# EAGLE design motoko_ice_dragon_x_dc (EAGLE 9.6.0)
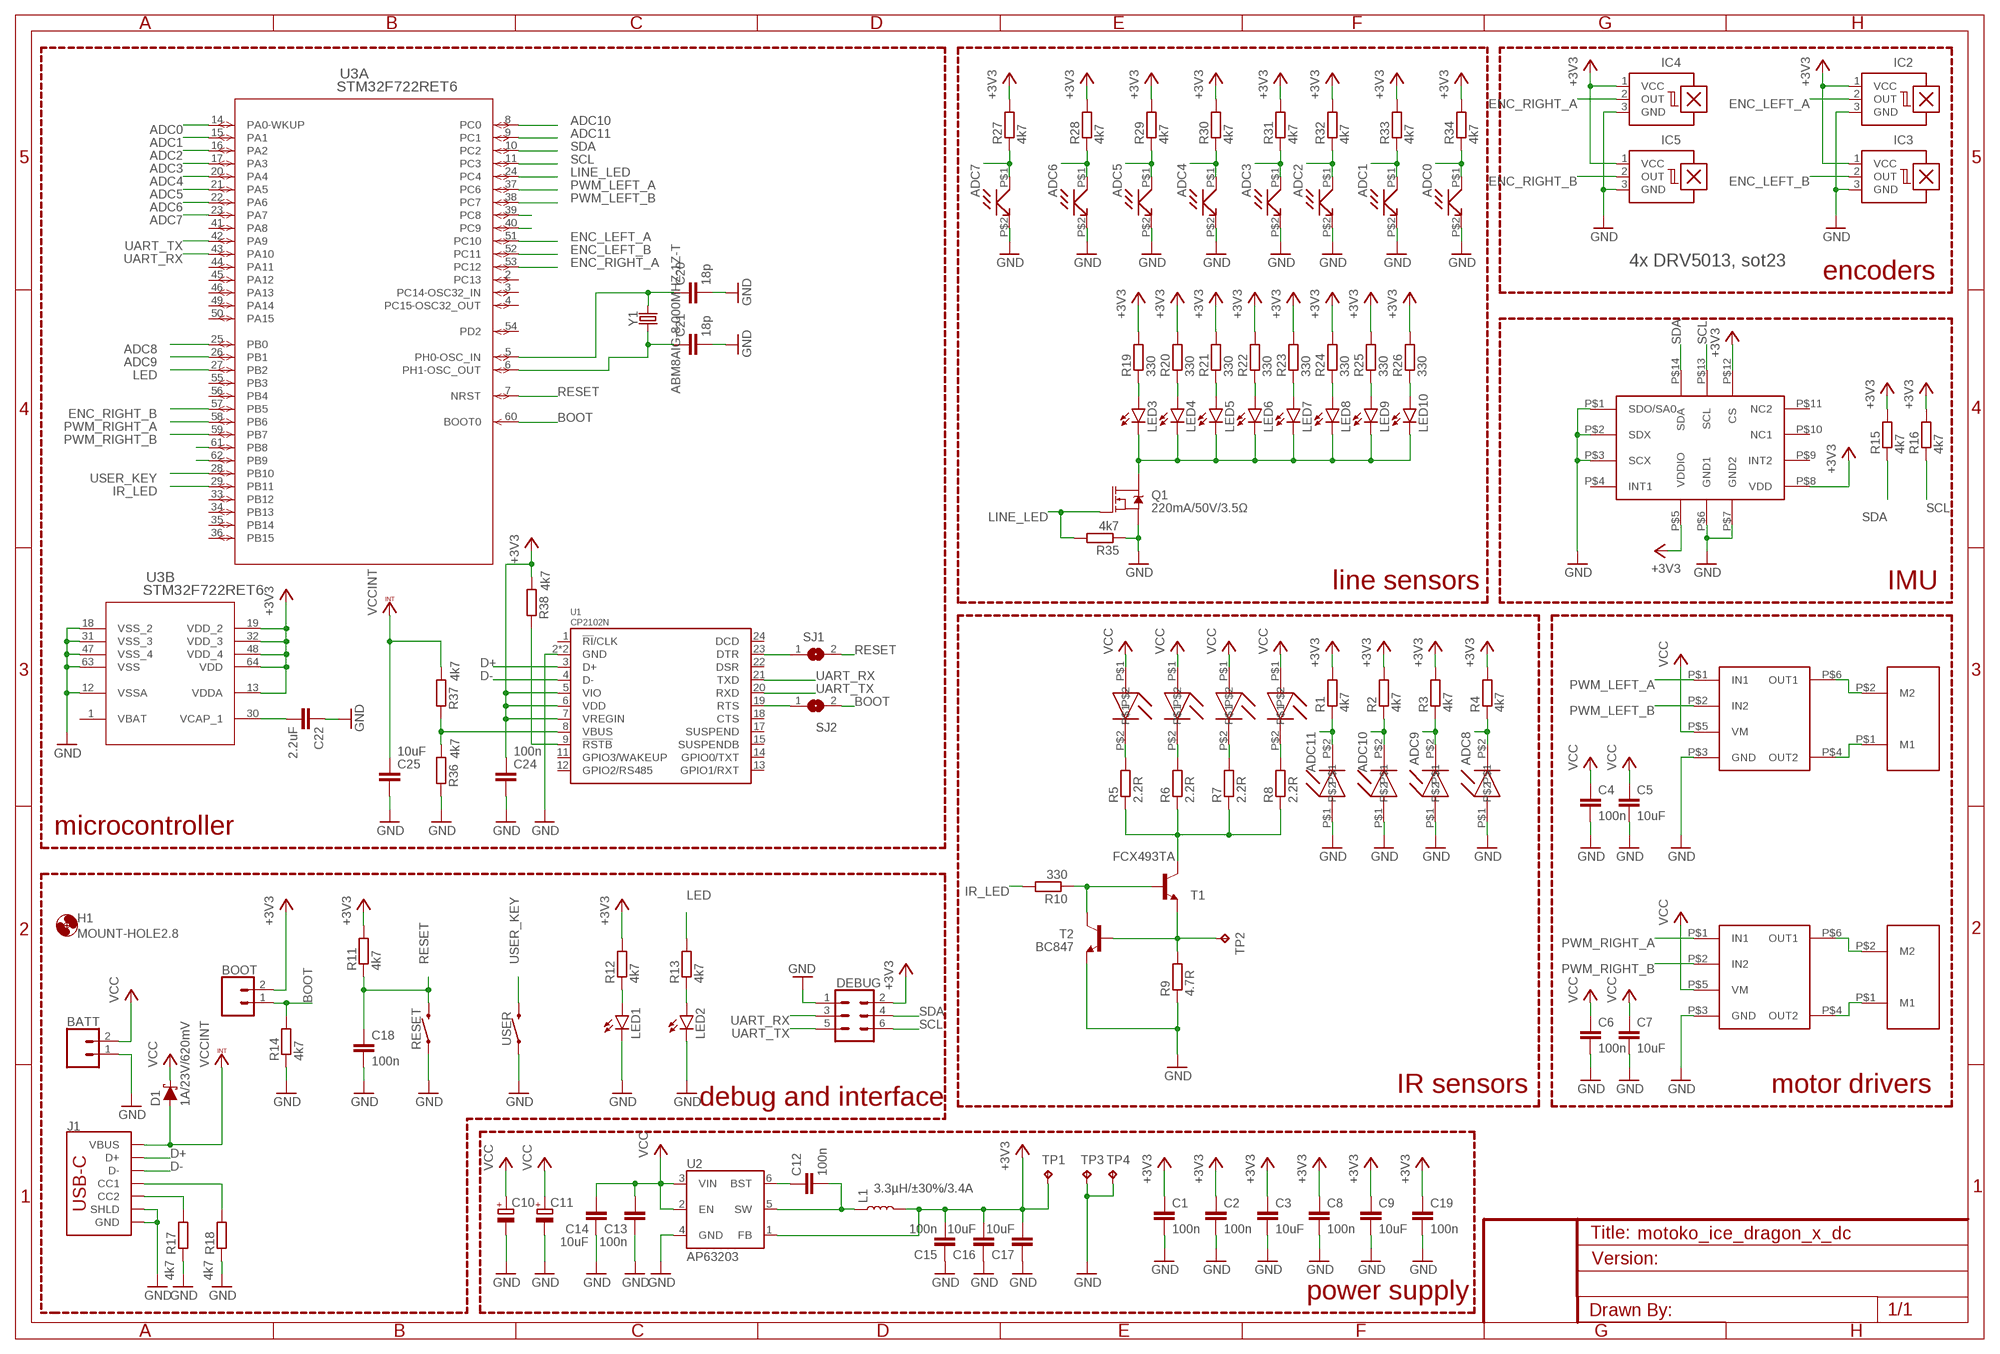
[diagram p0: schematic, sheet 1]

## Parts
BATT  CONN_02LOCK_LONGPADS  [1X02_LOCK_LONGPADS]
BOOT  CONN_02LOCK_LONGPADS  [1X02_LOCK_LONGPADS]
C1  100n  C-EUC0805  [C0805]
C2  100n  C-EUC0805  [C0805]
C3  10uF  C-EUC0805  [C0805]
C4  100n  C-EUC0805  [C0805]
C5  10uF  C-EUC0805  [C0805]
C6  100n  C-EUC0805  [C0805]
C7  10uF  C-EUC0805  [C0805]
C8  100n  C-EUC0805  [C0805]
C9  10uF  C-EUC0805  [C0805]
C10  CPOL-EU140CLH-0810  [140CLH-0810]
C11  CPOL-EU140CLH-0810  [140CLH-0810]
C12  100n  C-EUC0805  [C0805]
C13  100n  C-EUC0805  [C0805]
C14  10uF  C-EUC0805  [C0805]
C15  100n  C-EUC0805  [C0805]
C16  10uF  C-EUC0805  [C0805]
C17  10uF  C-EUC0805  [C0805]
C18  100n  C-EUC0805  [C0805]
C19  100n  C-EUC0805  [C0805]
C20  18p  C-EUC0805  [C0805]
C21  18p  C-EUC0805  [C0805]
C22  2.2uF  C-EUC0805  [C0805]
C24  100n  C-EUC0805  [C0805]
C25  10uF  C-EUC0805  [C0805]
D1  1A/23V/620mV  DIODE-SCHOTTKY-BAT20J  [SOD-323]
DEBUG  FEMALE 2x3  CONN_03X2FEMALE  [2X3]
H1  MOUNT-HOLE2.8  [2,8]
IC2  A1202LH  [SOT23-W]
IC3  A1202LH  [SOT23-W]
IC4  A1202LH  [SOT23-W]
IC5  A1202LH  [SOT23-W]
J1  640-USB4105-GF-A-120, man. GCT  USB_C_2-LAYER_PADS  [USB-C-16P-2LAYER-PADS]
L1  3.3µH/±30%/3.4A  INDUCTOR-CR54-3.3UH  [CR54]
LED1  LEDCHIPLED_1206  [CHIPLED_1206]
LED2  LEDCHIPLED_1206  [CHIPLED_1206]
LED3  LEDCHIPLED_1206  [CHIPLED_1206]
LED4  LEDCHIPLED_1206  [CHIPLED_1206]
LED5  LEDCHIPLED_1206  [CHIPLED_1206]
LED6  LEDCHIPLED_1206  [CHIPLED_1206]
LED7  LEDCHIPLED_1206  [CHIPLED_1206]
LED8  LEDCHIPLED_1206  [CHIPLED_1206]
LED9  LEDCHIPLED_1206  [CHIPLED_1206]
LED10  LEDCHIPLED_1206  [CHIPLED_1206]
Q1  220mA/50V/3.5Ω  MOSFET-NCH-BSS138  [SOT23-3]
R1  4k7  R-EU_M0805  [M0805]
R2  4k7  R-EU_M0805  [M0805]
R3  4k7  R-EU_M0805  [M0805]
R4  4k7  R-EU_M0805  [M0805]
R5  2.2R  R-EU_M0805  [M0805]
R6  2.2R  R-EU_M0805  [M0805]
R7  2.2R  R-EU_M0805  [M0805]
R8  2.2R  R-EU_M0805  [M0805]
R9  4.7R  R-EU_M0805  [M0805]
R10  330  R-EU_M0805  [M0805]
R11  4k7  R-EU_M0805  [M0805]
R12  4k7  R-EU_M0805  [M0805]
R13  4k7  R-EU_M0805  [M0805]
R14  4k7  R-EU_M0805  [M0805]
R15  4k7  R-EU_M0805  [M0805]
R16  4k7  R-EU_M0805  [M0805]
R17  4k7  R-EU_M0805  [M0805]
R18  4k7  R-EU_M0805  [M0805]
R19  330  R-EU_M0805  [M0805]
R20  330  R-EU_M0805  [M0805]
R21  330  R-EU_M0805  [M0805]
R22  330  R-EU_M0805  [M0805]
R23  330  R-EU_M0805  [M0805]
R24  330  R-EU_M0805  [M0805]
R25  330  R-EU_M0805  [M0805]
R26  330  R-EU_M0805  [M0805]
R27  4k7  R-EU_M0805  [M0805]
R28  4k7  R-EU_M0805  [M0805]
R29  4k7  R-EU_M0805  [M0805]
R30  4k7  R-EU_M0805  [M0805]
R31  4k7  R-EU_M0805  [M0805]
R32  4k7  R-EU_M0805  [M0805]
R33  4k7  R-EU_M0805  [M0805]
R34  4k7  R-EU_M0805  [M0805]
R35  4k7  R-EU_M0805  [M0805]
R36  4k7  R-EU_M0805  [M0805]
R37  4k7  R-EU_M0805  [M0805]
R38  4k7  R-EU_M0805  [M0805]
RESET  MOMENTARY-SWITCH-SPST-SMD-6.2MM-TALL  [TACTILE_SWITCH_SMD_6.2MM_TALL]
SJ1  SJ  [SJ]
SJ2  SJ  [SJ]
T1  FCX493TA  -NPN-SOT89-BCE  [SOT89-BCE]
T2  BC847  [SOT23]
TP1  TPB1,27  [B1,27]
TP2  TPB1,27  [B1,27]
TP3  TPB1,27  [B1,27]
TP4  TPB1,27  [B1,27]
U1  CP2102N  [QFN24]
U2  AP63203  [SOT23-6]
U3  STM32F722RET6  [LQFP64-10X10MM]
U$1  DRV8212  [SOT_0.6MM]
U$2  SFH3710  [SFH710]
U$3  DRV8212  [SOT_0.6MM]
U$4  POLOLU_MICRO_METAL_GEAR_MOTOR  [POLOLU_MICRO_METAL_GEAR_MOTOR]
U$5  POLOLU_MICRO_METAL_GEAR_MOTOR  [POLOLU_MICRO_METAL_GEAR_MOTOR]
U$6  LSM6DSM  [LGA14L]
U$7  LED_5MM_AXIAL  [LED_5MM_AXIAL]
U$8  LED_5MM_AXIAL  [LED_5MM_AXIAL]
U$9  LED_5MM_AXIAL  [LED_5MM_AXIAL]
U$10  LED_5MM_AXIAL  [LED_5MM_AXIAL]
U$11  LED_5MM_AXIAL  [LED_5MM_AXIAL]
U$12  LED_5MM_AXIAL  [LED_5MM_AXIAL]
U$13  LED_5MM_AXIAL  [LED_5MM_AXIAL]
U$14  LED_5MM_AXIAL  [LED_5MM_AXIAL]
U$15  SFH3710  [SFH710]
U$16  SFH3710  [SFH710]
U$17  SFH3710  [SFH710]
U$18  SFH3710  [SFH710]
U$19  SFH3710  [SFH710]
U$20  SFH3710  [SFH710]
U$21  SFH3710  [SFH710]
USER  MOMENTARY-SWITCH-SPST-SMD-6.2MM-TALL  [TACTILE_SWITCH_SMD_6.2MM_TALL]
Y1  ABM8AIG-8.000MHZ-1Z-T  CRYSTALSMD-3.2X2.5  [CRYSTAL-SMD-3.2X2.5MM]

## Nets
+3V3: BOOT.2 C1.1 C2.1 C3.1 C8.1 C9.1 C15.2 C16.2 C17.2 C19.1 C24.1 DEBUG.2 IC2.1(VCC) IC3.1(VCC) IC4.1(VCC) IC5.1(VCC) L1.P$2 R1.2 R2.2 R3.2 R4.2 R11.2 R12.2 R15.2 R16.2 R19.2 R20.2 R21.2 R22.2 R23.2 R24.2 R25.2 R26.2 R27.2 R28.2 R29.2 R30.2 R31.2 R32.2 R33.2 R34.2 R38.1 TP1.TP U1.5(VIO) U1.6(VDD) U1.7(VREGIN) U2.1(FB) U3.13(B:VDDA) U3.19(B:VDD_2) U3.32(B:VDD_3) U3.48(B:VDD_4) U3.64(B:VDD) U$6.P$5(VDDIO) U$6.P$8(VDD) U$6.P$12(CS)
ADC0: R34.1 U3.14(A:PA0-WKUP) U$21.P$1(C)
ADC1: R33.1 U3.15(A:PA1) U$20.P$1(C)
ADC2: R32.1 U3.16(A:PA2) U$19.P$1(C)
ADC3: R31.1 U3.17(A:PA3) U$18.P$1(C)
ADC4: R30.1 U3.20(A:PA4) U$17.P$1(C)
ADC5: R29.1 U3.21(A:PA5) U$16.P$1(C)
ADC6: R28.1 U3.22(A:PA6) U$15.P$1(C)
ADC7: R27.1 U3.23(A:PA7) U$2.P$1(C)
ADC8: R4.1 U3.25(A:PB0) U$7.P$2
ADC9: R3.1 U3.26(A:PB1) U$11.P$2
ADC10: R2.1 U3.8(A:PC0) U$14.P$2
ADC11: R1.1 U3.9(A:PC1) U$9.P$2
BOOT: BOOT.1 R14.2 SJ2.2 U3.60(A:BOOT0)
D+: J1.A6(D+) J1.B6(D+) U1.3(D+)
D-: J1.A7(D-) J1.B7(D-) U1.4(D-)
ENC_LEFT_A: IC2.2(OUT) U3.51(A:PC10)
ENC_LEFT_B: IC3.2(OUT) U3.52(A:PC11)
ENC_RIGHT_A: IC4.2(OUT) U3.53(A:PC12)
ENC_RIGHT_B: IC5.2(OUT) U3.57(A:PB5)
GND: BATT.1 C1.2 C2.2 C3.2 C4.2 C5.2 C6.2 C7.2 C8.2 C9.2 C10.- C11.- C13.1 C14.1 C15.1 C16.1 C17.1 C18.2 C19.2 C20.2 C21.2 C22.1 C24.2 C25.2 DEBUG.1 IC2.3(GND) IC3.3(GND) IC4.3(GND) IC5.3(GND) J1.GND J1.GND2(GND) J1.SHLD1(SHLD) J1.SHLD2(SHLD) J1.SHLD3(SHLD) J1.SHLD4(SHLD) LED1.C LED2.C Q1.2(S) R9.1 R14.1 R17.1 R18.1 R35.1 R36.2 RESET.A2 T2.2(E) TP3.TP TP4.TP U1.2(GND) U1.PAD(GND) U2.4(GND) U3.12(B:VSSA) U3.18(B:VSS_2) U3.31(B:VSS_3) U3.47(B:VSS_4) U3.63(B:VSS) U$1.P$3(GND) U$2.P$2(E) U$3.P$3(GND) U$6.P$1(SDO/SA0) U$6.P$2(SDX) U$6.P$3(SCX) U$6.P$6(GND1) U$6.P$7(GND2) U$7.P$1 U$9.P$1 U$11.P$1 U$14.P$1 U$15.P$2(E) U$16.P$2(E) U$17.P$2(E) U$18.P$2(E) U$19.P$2(E) U$20.P$2(E) U$21.P$2(E) USER.A2
IR_LED: R10.2 U3.29(A:PB11)
LED: R13.2 U3.27(A:PB2)
LINE_LED: Q1.1(G) R35.2 U3.24(A:PC4)
N$1: U$1.P$6(OUT1) U$4.P$2(M2)
N$2: U$1.P$4(OUT2) U$4.P$1(M1)
N$3: U$3.P$6(OUT1) U$5.P$2(M2)
N$4: U$3.P$4(OUT2) U$5.P$1(M1)
N$5: R5.2 U$10.P$2
N$6: R6.2 U$13.P$2
N$7: R7.2 U$12.P$2
N$8: R8.2 U$8.P$2
N$9: SJ2.1 U1.19(RTS)
N$10: R9.2 T1.E T2.1(B) TP2.TP
N$11: J1.B5(CC2) R17.2
N$12: C12.1 U2.6(BST)
N$13: C12.2 L1.P$1 U2.5(SW)
N$14: R10.1 T1.B T2.3(C)
N$15: R5.1 R6.1 R7.1 R8.1 T1.C
N$16: LED1.A R12.1
N$17: LED2.A R13.1
N$18: J1.A5(CC1) R18.2
N$19: C20.1 U3.5(A:PH0-OSC_IN) Y1.3
N$20: C21.1 U3.6(A:PH1-OSC_OUT) Y1.1
N$21: LED3.A R19.1
N$22: LED4.A R20.1
N$23: C22.2 U3.30(B:VCAP_1)
N$24: LED5.A R21.1
N$25: LED6.A R22.1
N$26: LED7.A R23.1
N$27: LED8.A R24.1
N$28: LED9.A R25.1
N$29: LED10.A R26.1
N$30: LED3.C LED4.C LED5.C LED6.C LED7.C LED8.C LED9.C LED10.C Q1.3(D)
N$31: SJ1.1 U1.23(DTR)
N$32: R38.2 U1.9(!RSTB)
N$33: U3.61(A:PB8)
N$34: U3.62(A:PB9)
N$35: U3.39(A:PC8)
N$36: U3.40(A:PC9)
N$38: R36.1 R37.2 U1.8(VBUS)
PWM_LEFT_A: U3.37(A:PC6) U$1.P$1(IN1)
PWM_LEFT_B: U3.38(A:PC7) U$1.P$2(IN2)
PWM_RIGHT_A: U3.58(A:PB6) U$3.P$1(IN1)
PWM_RIGHT_B: U3.59(A:PB7) U$3.P$2(IN2)
RESET: C18.1 R11.1 RESET.B2 SJ1.2 U3.7(A:NRST)
SCL: DEBUG.6 R16.1 U3.11(A:PC3) U$6.P$13(SCL)
SDA: DEBUG.4 R15.1 U3.10(A:PC2) U$6.P$14(SDA)
UART_RX: DEBUG.3 U1.21(TXD) U3.43(A:PA10)
UART_TX: DEBUG.5 U1.20(RXD) U3.42(A:PA9)
USER_KEY: U3.28(A:PB10) USER.B2
VCC: BATT.2 C4.1 C5.1 C6.1 C7.1 C10.+ C11.+ C13.2 C14.2 D1.C U2.2(EN) U2.3(VIN) U$1.P$5(VM) U$3.P$5(VM) U$8.P$1 U$10.P$1 U$12.P$1 U$13.P$1
VCCINT: C25.1 D1.A J1.VBUS1(VBUS) J1.VBUS2(VBUS) R37.1
Unconnected: U1.1(!RI!/CLK) U1.11(GPIO3/WAKEUP) U1.12(GPIO2/RS485) U1.13(GPIO1/RXT) U1.14(GPIO0/TXT) U1.15(SUSPENDB) U1.17(SUSPEND) U1.18(CTS) U1.22(DSR) U1.24(DCD) U3.2(A:PC13) U3.3(A:PC14-OSC32_IN) U3.4(A:PC15-OSC32_OUT) U3.33(A:PB12) U3.34(A:PB13) U3.35(A:PB14) U3.36(A:PB15) U3.41(A:PA8) U3.44(A:PA11) U3.45(A:PA12) U3.46(A:PA13) U3.49(A:PA14) U3.50(A:PA15) U3.54(A:PD2) U3.55(A:PB3) U3.56(A:PB4) U$6.P$4(INT1) U$6.P$9(INT2) U$6.P$10(NC1) U$6.P$11(NC2)

## Notes on the sheet
- 4x DRV5013, sot23
- encoders
- line sensors | IMU
- microcontroller
- IR sensors | motor drivers
- debug and interface
- power supply

## Power pins joined to a net without a drawn wire
VBAT: U3.1(B:VBAT)

## Library data of the parts
BATT BOOT = SparkFun-Connectors:CONN_02: Multi connection point. Often used as Generic Header-pin footprint for 0.1 inch spaced/style header connections On any of the 0.1 inch spaced packages, you can populate with these: Break Away Headers - Straight <https://www.sparkfun.com/products/116> (PRT-00116) Break Away Male Headers - Right Angle <https://www.sparkfun.com/products/553> (PRT-00553) Female Headers <https://www.sparkfun.com/products/115> (PRT-00115) Break Away Headers - Machine Pin <https://www.sparkfun.com/products/117> (PRT-00117) Break Away Female Headers - Swiss Machine Pin <https://www.sparkfun.com/products/743> (PRT-00743) For SCREWTERMINALS and SPRING TERMINALS visit here: Screw Terimnals on SparkFun.com <https://www.sparkfun.com/search/results?term=Screw+Terminals> (5mm/3.5mm/2.54mm spacing) This device is also useful as a general connection point to wire up your design to another part of your project. Our various solder wires solder well into these plated through hole pads. Hook-Up Wire - Assortment (Stranded, 22 AWG) <https://www.sparkfun.com/products/11375> (PRT-11375) Hook-Up Wire - Assortment (Solid Core, 22 AWG) <https://www.sparkfun.com/products/11367> (PRT-11367) View the entire wire category on our website here <https://www.sparkfun.com/categories/141> Special notes: Molex polarized connector foot print use with: PRT-08233 with associated crimp pins and housings. 2.54_SCREWTERM for use with PRT-10571. 3.5mm Screw Terminal footprints for PRT-08084 5mm Screw Terminal footprints for use with PRT-08432
C1-C9 C12-C22 C24 C25 = rcl:C-EU: CAPACITOR, European symbol; SPICEPREFIX: C
C10 C11 = rcl:CPOL-EU: POLARIZED CAPACITOR, European symbol; SPICEPREFIX: C
D1 = SparkFun-DiscreteSemi:DIODE-SCHOTTKY: Schottky diode A Schottky diode is a semiconductor diode which has a low forward voltage drop and a very fast switching action.; PROD_ID: DIO-11623
DEBUG = SparkFun-Connectors:CONN_03X2: Multi connection point. Often used as Generic Header-pin footprint for 0.1 inch spaced/style header connections You can populate with any combo of single row headers, but if you'd like an exact match, check these: Header - 2x3 (Male, 0.1") <https://www.sparkfun.com/products/12807> (PRT-12807) Header - 2x3 (Female, 0.1") <https://www.sparkfun.com/products/13010> (PRT-13010) 2x3 Pin Shrouded Header <https://www.sparkfun.com/products/10877> (PRT-10877) On any of the 0.1 inch spaced packages, you can populate with these: Break Away Headers - Straight <https://www.sparkfun.com/products/116> (PRT-00116) Break Away Male Headers - Right Angle <https://www.sparkfun.com/products/553> (PRT-00553) Female Headers <https://www.sparkfun.com/products/115> (PRT-00115) Break Away Headers - Machine Pin <https://www.sparkfun.com/products/117> (PRT-00117) Break Away Female Headers - Swiss Machine Pin <https://www.sparkfun.com/products/743> (PRT-00743) Special note: the shrouded connector mates well with our 3x2 ribbon cables: Ribbon Crimp Connector - 6-pin (2x3, Female) <https://www.sparkfun.com/products/10651> (PRT-10651) Ribbon Cable - 6 wire (15ft) <https://www.sparkfun.com/products/10646> (PRT-10646); PROD_ID: CONN-11566
H1 = holes:MOUNT-HOLE: MOUNTING HOLE with drill center marker
IC2-IC5 = allegro:A12*?: Hall-effect bipolar switch Source: http://www.allegromicro.com/en/Products/Part_Numbers/1202/1202.pdf; OC_FARNELL: unknown; OC_NEWARK: unknown
J1 = SparkFun-Connectors:USB_C: USB Type C 16Pin Connector Super Speed pins not available on the 16-pin purely SMD connector so this part is best for USB 2.0 implementations. D1 and D2 are tied together enabling D+/- no matter which way the cable is plugged into the connector. The two channel configuration pins (CC1/2) are exposed. These are normally connected to ground via 5.1k resistors but can be reconfigured for high current/high power applications.; PROD_ID: CONN-14122
L1 = SparkFun-Coils:INDUCTOR: Inductors Resist changes in electrical current. Basically a coil of wire. SparkFun Products: SparkFun Load Cell Amplifier - HX711 <https://www.sparkfun.com/products/13879> IOIO-OTG - V2.2 <https://www.sparkfun.com/products/13613>; PROD_ID: NDUC-11157
LED1-LED10 = led:LED: LED OSRAM: - CHIPLED LG R971, LG N971, LY N971, LG Q971, LY Q971, LO R971, LY R971 LH N974, LH R974 LS Q976, LO Q976, LY Q976 LO Q996 - Hyper CHIPLED LW Q18S LB Q993, LB Q99A, LB R99A - SideLED LS A670, LO A670, LY A670, LG A670, LP A670 LB A673, LV A673, LT A673, LW A673 LH A674 LY A675 LS A676, LA A676, LO A676, LY A676, LW A676 LS A679, LY A679, LG A679 - Hyper Micro SIDELED® LS Y876, LA Y876, LO Y876, LY Y876 LT Y87S - SmartLED LW L88C, LW L88S LB L89C, LB L89S, LG L890 LS L89K, LO L89K, LY L89K LS L896, LA L896, LO L896, LY L896 - TOPLED LS T670, LO T670, LY T670, LG T670, LP T670 LSG T670, LSP T670, LSY T670, LOP T670, LYG T670 LG T671, LOG T671, LSG T671 LB T673, LV T673, LT T673, LW T673 LH T674 LS T676, LA T676, LO T676, LY T676, LB T676, LH T676, LSB T676, LW T676 LB T67C, LV T67C, LT T67C, LS T67K, LO T67K, LY T67K, LW E67C LS E67B, LA E67B, LO E67B, LY E67B, LB E67C, LV E67C, LT E67C LW T67C LS T679, LY T679, LG T679 LS T770, LO T770, LY T770, LG T770, LP T770 LB T773, LV T773, LT T773, LW T773 LH T774 LS E675, LA E675, LY E675, LS T675 LS T776, LA T776, LO T776, LY T776, LB T776 LHGB T686 LT T68C, LB T68C - Hyper Mini TOPLED® LB M676 - Mini TOPLED Santana® LG M470 LS M47K, LO M47K, LY M47K Source: http://www.osram.convergy.de LUXEON: - LUMILED® LXK2-PW12-R00, LXK2-PW12-S00, LXK2-PW14-U00, LXK2-PW14-V00 LXK2-PM12-R00, LXK2-PM12-S00, LXK2-PM14-U00 LXK2-PE12-Q00, LXK2-PE12-R00, LXK2-PE12-S00, LXK2-PE14-T00, LXK2-PE14-U00 LXK2-PB12-K00, LXK2-PB12-L00, LXK2-PB12-M00, LXK2-PB14-N00, LXK2-PB14-P00, LXK2-PB14-Q00 LXK2-PR12-L00, LXK2-PR12-M00, LXK2-PR14-Q00, LXK2-PR14-R00 LXK2-PD12-Q00, LXK2-PD12-R00, LXK2-PD12-S00 LXK2-PH12-R00, LXK2-PH12-S00 LXK2-PL12-P00, LXK2-PL12-Q00, LXK2-PL12-R00 Source: www.luxeon.com KINGBRIGHT: KA-3528ASYC Source: www.kingbright.com
Q1 = SparkFun-DiscreteSemi:MOSFET-NCH: N-channel MOSFETs Voltage controlled devices that allow control of high current outputs. SparkFun Products: SparkFun OpenScale <https://www.sparkfun.com/products/13261> SparkFun Digital Sandbox <https://www.sparkfun.com/products/12651> SparkFun Monster Moto Shield <https://www.sparkfun.com/products/10182> SparkFun MOSFET Power Controller <https://www.sparkfun.com/products/11214>; PROD_ID: TRANS-00830
R1-R38 = rcl:R-EU_: RESISTOR, European symbol; SPICEPREFIX: R
RESET USER = SparkFun-Switches:MOMENTARY-SWITCH-SPST: Momentary Switch (Pushbutton) - SPST Normally-open (NO) SPST momentary switches (buttons, pushbuttons). Variants PTH-12MM - 12mm square, through-hole Momentary Pushbutton Switch - 12mm Square <https://www.sparkfun.com/products/9190> (COM-09190) PTH-6.0MM, PTH-6.0MM-KIT - 6.0mm square, through-hole Mini Pushbutton Switch <https://www.sparkfun.com/products/97> (COM-00097) KIT package intended for soldering kit's - only one side of pads' copper is exposed. PTH-RIGHT-ANGLE-KIT - Right-angle, through-hole Right Angle Tactile Button <https://www.sparkfun.com/products/10791> - Used on SparkFun BigTime Watch Kit <https://www.sparkfun.com/products/11734> SMD-12MM - 12mm square, surface-mount Tactile Button - SMD (12mm) <https://www.sparkfun.com/products/12993> (COM-12993) Used on SparkFun PicoBoard <https://www.sparkfun.com/products/11888> SMD-4.5MM - 4.5mm Square Trackball Switch Used on SparkFun Blackberry Trackballer Breakout <https://www.sparkfun.com/products/13169> SMD-4.6MMX2.8MM - 4.60mm x 2.80mm, surface mount Used on SparkFun SAMD21 Mini Breakout <https://www.sparkfun.com/products/13664> SMD-5.2MM, SMD-5.2-REDUNDANT - 5.2mm square, surface-mount Mini Pushbutton Switch - SMD <https://www.sparkfun.com/products/8720> (COM-08720) Used on Arduino Pro Mini <https://www.sparkfun.com/products/11114> REDUNDANT package connects both switch circuits together SMD-6.0X3.5MM - 6.0 x 3.5mm, surface mount Momentary Reset Switch SMD <https://www.sparkfun.com/products/8229> (COM-08229) SMD-6.2MM-TALL - 6.2mm square, surface mount Tactile Button - SMD (6mm) <https://www.sparkfun.com/products/12992> Used on SparkFun Digital Sandbox <https://www.sparkfun.com/products/12651> SMD-RIGHT-ANGLE - Right-angle, surface mount Used on SparkFun Block for Intel® Edison - Arduino <https://www.sparkfun.com/products/13036>; PROD_ID: SWCH-11966; SF_SKU: COM-12992
SJ1 SJ2 = jumper:SJ: SMD solder JUMPER
T1 = transistor:*-NPN-: NPN Transistror BF959 corrected 2008.03.06
T2 = transistor-neu-to92:BC847: NPN TRANSISTOR
TP1-TP4 = testpad:TP: Test pad
U1 = SparkFun-IC-Comms:CP2102N; PROD_ID: IC-14020
U2 = SparkFun-IC-Power:AP63203: Diodes Inc. AP63203 3.8V-32V input 3.3V Buck The AP63200/AP63201/AP63203/AP63205 is a 2A, synchronous buck converter with a wide input voltage range of 3.8V to 32V and fully integrates a 125mΩ high-side power MOSFET and a 68mΩ lowside power MOSFET to provide high-efficiency step-down DC/DC conversion; PROD_ID: VREG-15244
U3 = my_library:STM32F722RET6; COPYRIGHT: Copyright (C) 2024 Ultra Librarian. All rights reserved.; MANUFACTURER_PART_NUMBER: STM32F722RET6; MFR_NAME: STMicroelectronics
U$1 U$3 = my_library:DRV8212
U$2 U$15-U$21 = my_library:SFH3710
U$4 U$5 = my_library:POLOLU_MICRO_METAL_GEAR_MOTOR
U$6 = my_library:LSM6DSM
U$7-U$11 U$13 U$14 = my_library:LED_5MM_AXIAL
U$12 = my_library:LED_5MM_AXIAL; SPICEPREFIX: B
Y1 = SparkFun-Clocks:CRYSTAL: Crystals (Generic) These are passive quartz crystals, which can be used as a clock source for a microcontroller. Crystal's are two-terminal devices. They require external "load" capacitors to generate an oscillating signal.

## Board
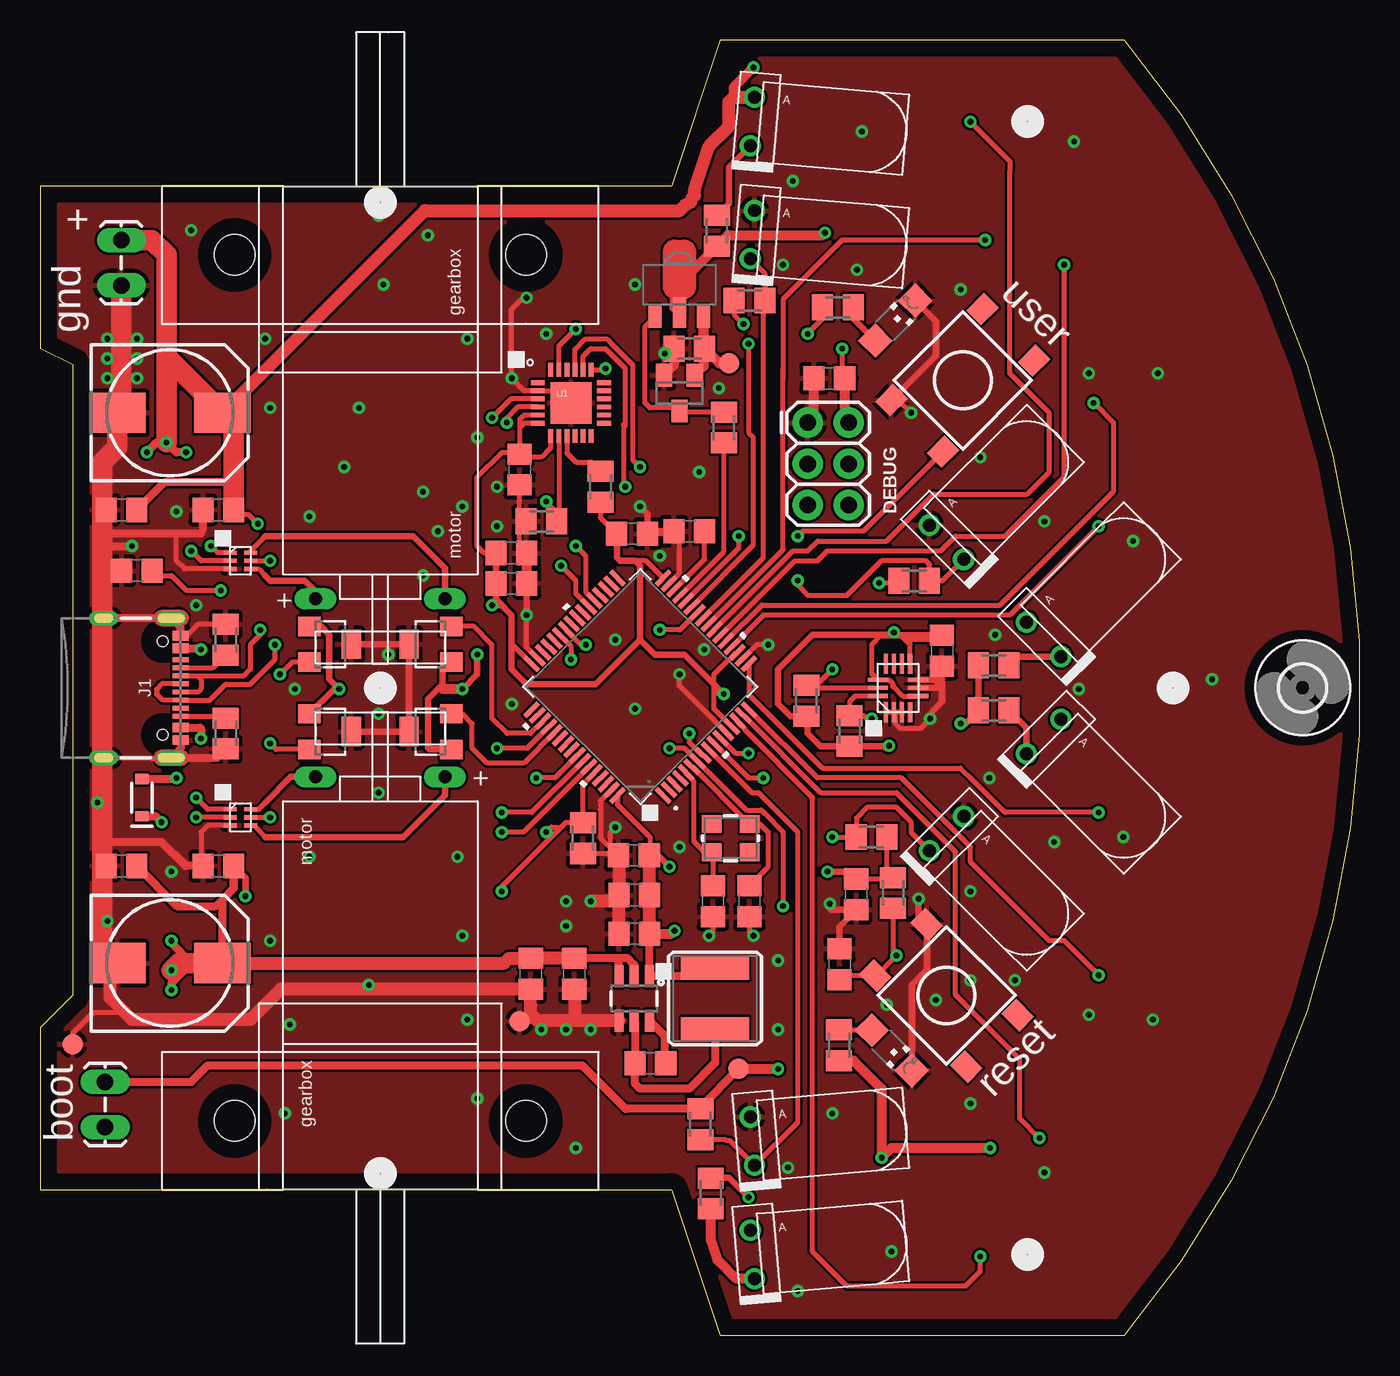
[diagram p1: board, top side]
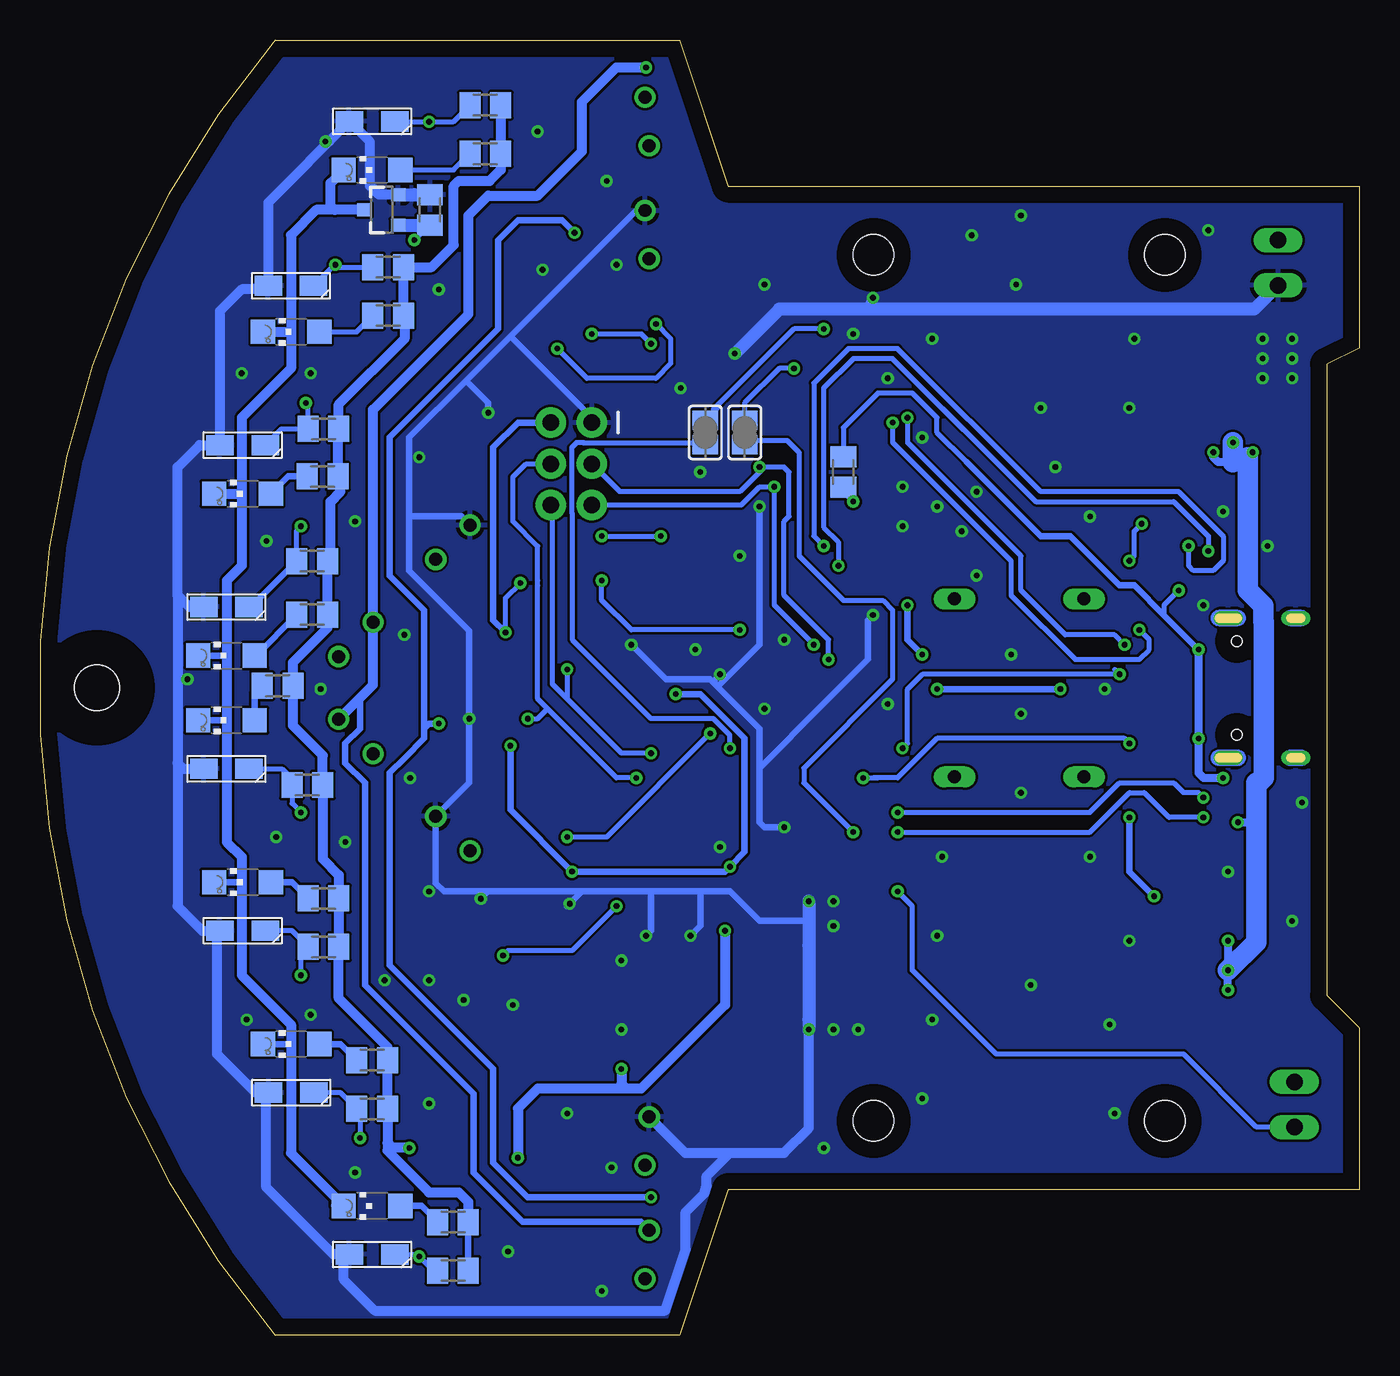
[diagram p2: board, bottom side, seen from below]

Size 81.49 x 80 mm. Coordinates in mm from the lower left corner, seen from the top.
Outline: 0,9 39,9 42,0 67,0 arc80 67,80 43,80 42,80 39,71 0,71 0,61 2,60 2,21 0,19 0,9
Copper layers (1*16): Top 0.035mm / dielectric 1.5mm / Bottom 0.035mm
Design rules "default": minimum track width 6mil, minimum drill 0.35mm, track to track 6mil, track to pad 6mil, pad to pad 6mil, via to via 6mil, smd to smd 6mil, copper to edge 40mil, drill to drill 6mil, minimum pad ring 10mil, minimum via ring 8mil, stop-mask expansion 4mil, vias tented up to drill 0mil, thermal gap 10mil

### Footprints (pad centres in the part's own frame; a part is rotated, then mirrored left to right if it is on the bottom)
1X02_LOCK_LONGPADS = drill 1.016 long: 1 -0.127,0; 2 2.667,0
C0805 = smd 1.3 x 1.5: 1 -0.95,0; 2 0.95,0
140CLH-0810 = smd 3.5 x 2.5: + 3.25,0; - -3.25,0
SOD-323 = smd 0.63 x 0.83: A 1.15,0; C -1.15,0
2X3 = drill 1.016 pad 1.88: 1 0,0; 2 0,2.54; 3 2.54,0; 4 2.54,2.54; 5 5.08,0; 6 5.08,2.54
2,8 = hole 2.8: 0,0
SOT23-W = smd 1.2 x 1.4: 1 -1.1,-1.3; 2 1.1,-1.3 | smd 1.8 x 1.2: 3 0,1.3
USB-C-16P-2LAYER-PADS = smd 0.3 x 1: A5 -1.25,-0.34; A6 -0.25,-0.34; A7 0.25,-0.34; A8 1.25,-0.34; B5 1.75,-0.34; B6 0.75,-0.34; B7 -0.75,-0.34; B8 -1.75,-0.34 | smd 0.6 x 1: GND -3.225,-0.34; GND2 3.225,-0.34; VBUS1 -2.45,-0.34; VBUS2 2.45,-0.34 | drill 0.4 pad 0.6 long: SHLD1 -4.318,-0.915; SHLD2 4.318,-0.915; SHLD3 -4.318,-5.095; SHLD4 4.318,-5.095 | hole 0.65: -2.89,-1.445; 2.89,-1.445
CR54 = smd 4.2 x 1.4: P$1 0,1.85; P$2 0,-1.85
CHIPLED_1206 = smd 1.5 x 1.5: A 0,-1.75; C 0,1.75
SOT23-3 = smd 0.8 x 0.9: 1 -0.95,-1; 2 0.95,-1; 3 0,1.1
M0805 = smd 1.3 x 1.6: 1 -0.95,0; 2 0.95,0
TACTILE_SWITCH_SMD_6.2MM_TALL = smd 1.55 x 1.3: A1 -3.975,-2.25; A2 3.975,-2.25; B1 -3.975,2.25; B2 3.975,2.25
SJ = smd 1.168 x 1.6: 1 -0.762,0; 2 0.762,0
SOT89-BCE = smd 0.8 x 1.4: B -1.499,-1.981; E 1.499,-1.981 | smd 0.8 x 1.9: C 0,-1.727
SOT23 = smd 1 x 1.4: 1 -0.95,-1.1; 2 0.95,-1.1; 3 0,1.1
B1,27 = smd 1.27 x 1.27: TP 0,0
QFN24 = smd 0.85 x 0.3: 1 -2.05,1.25; 2 -2.05,0.75; 3 -2.05,0.25; 4 -2.05,-0.25; 5 -2.05,-0.75; 6 -2.05,-1.25; 13 2.05,-1.25; 14 2.05,-0.75; 15 2.05,-0.25; 16 2.05,0.25; 17 2.05,0.75; 18 2.05,1.25 | smd 0.3 x 0.85: 7 -1.25,-2.05; 8 -0.75,-2.05; 9 -0.25,-2.05; 10 0.25,-2.05; 11 0.75,-2.05; 12 1.25,-2.05; 19 1.25,2.05; 20 0.75,2.05; 21 0.25,2.05; 22 -0.25,2.05; 23 -0.75,2.05; 24 -1.25,2.05 | smd 2.55 x 2.55: PAD 0,0
SOT23-6 = smd 0.55 x 1.35: 1 -0.95,-1.375; 2 0,-1.375; 3 0.95,-1.375; 4 0.95,1.375; 5 0,1.375; 6 -0.95,1.375
LQFP64-10X10MM = smd 1.194 x 0.305: 1 -5.75,3.75; 2 -5.75,3.25; 3 -5.75,2.75; 4 -5.75,2.25; 5 -5.75,1.75; 6 -5.75,1.25; 7 -5.75,0.75; 8 -5.75,0.25; 9 -5.75,-0.25; 10 -5.75,-0.75; 11 -5.75,-1.25; 12 -5.75,-1.75; 13 -5.75,-2.25; 14 -5.75,-2.75; 15 -5.75,-3.25; 16 -5.75,-3.75; 33 5.75,-3.75; 34 5.75,-3.25; 35 5.75,-2.75; 36 5.75,-2.25; 37 5.75,-1.75; 38 5.75,-1.25; 39 5.75,-0.75; 40 5.75,-0.25; 41 5.75,0.25; 42 5.75,0.75; 43 5.75,1.25; 44 5.75,1.75; 45 5.75,2.25; 46 5.75,2.75; 47 5.75,3.25; 48 5.75,3.75 | smd 0.305 x 1.194: 17 -3.75,-5.75; 18 -3.25,-5.75; 19 -2.75,-5.75; 20 -2.25,-5.75; 21 -1.75,-5.75; 22 -1.25,-5.75; 23 -0.75,-5.75; 24 -0.25,-5.75; 25 0.25,-5.75; 26 0.75,-5.75; 27 1.25,-5.75; 28 1.75,-5.75; 29 2.25,-5.75; 30 2.75,-5.75; 31 3.25,-5.75; 32 3.75,-5.75; 49 3.75,5.75; 50 3.25,5.75; 51 2.75,5.75; 52 2.25,5.75; 53 1.75,5.75; 54 1.25,5.75; 55 0.75,5.75; 56 0.25,5.75; 57 -0.25,5.75; 58 -0.75,5.75; 59 -1.25,5.75; 60 -1.75,5.75; 61 -2.25,5.75; 62 -2.75,5.75; 63 -3.25,5.75; 64 -3.75,5.75
SOT_0.6MM = smd 0.8 x 0.27: P$1 -0.625,0.5; P$2 -0.625,0; P$3 -0.625,-0.5; P$4 0.625,-0.5; P$5 0.625,0; P$6 0.625,0.5
SFH710 = smd 1.7 x 1.25: P$1 -1.4,0; P$2 1.4,0
POLOLU_MICRO_METAL_GEAR_MOTOR = drill 0.8 long: P$1 -1.5,4; P$2 -1.5,-4 | hole 2.5: 19.75,9; 19.75,-9
LGA14L = smd 1.25 x 0.25: P$1 -1.5,0.75; P$2 -1.5,0.25; P$3 -1.5,-0.25; P$4 -1.5,-0.75; P$8 1.5,-0.75; P$9 1.5,-0.25; P$10 1.5,0.25; P$11 1.5,0.75 | smd 0.25 x 1.25: P$5 -0.5,-1.25; P$6 0,-1.25; P$7 0.5,-1.25; P$12 0.5,1.25; P$13 0,1.25; P$14 -0.5,1.25
LED_5MM_AXIAL = drill 0.8: P$1 0,1.5; P$2 0,-1.5
CRYSTAL-SMD-3.2X2.5MM = smd 1.2 x 1.1: 1 -1.175,-0.875; 2 1.175,-0.875; 3 1.175,0.875; 4 -1.175,0.875

### Placement (x,y rotation side)
BATT  5,65 90 top
BOOT  4,13 90 top
C1  36.56,49.52 0 top
C2  48.75,59.13 180 top
C3  50.42,27.25 270 top
C4  11,51 180 top
C5  5,51 180 top
C6  11,29 180 top
C7  5,29 180 top
C8  29.1,48.33 0 top
C9  29.1,46.46 0 top
C10  8,57 0 top
C11  8,23 0 top
C12  37.7,16.81 180 top
C13  33,22.34 90 top
C14  30.3,22.34 90 top
C15  36.7,27.2 0 top
C16  36.68,29.66 0 top
C17  36.7,24.81 0 top
C18  49.38,22.93 90 top
C19  55.72,42.3 270 top
C20  41.56,26.82 270 top
C21  43.82,26.82 270 top
C22  40.1,49.68 0 top
C24  29.61,53.49 270 top
C25  5.96,47.24 180 top
D1  6.27,33.22 90 top
DEBUG  47.42,56.39 270 top
H1  78,40 0 top
IC2  24.09,42.7 90 top
IC3  17.91,42.7 270 top
IC4  24.09,37.3 90 top
IC5  17.91,37.3 270 top
J1  9,40 270 top
L1  41.7,20.81 180 top
LED1  52.61,17.61 225 top
LED2  52.83,62.7 315 top
LED3  61,72 90 bottom
LED4  66,62 90 bottom
LED5  69,52 90 bottom
LED6  70,42 90 bottom
LED7  70,38 90 bottom
LED8  69,28 90 bottom
LED9  66,18 90 bottom
LED10  61,8 90 bottom
Q1  60.38,69.53 90 bottom
R1  40.78,13.05 90 top
R2  51.36,30.79 0 top
R3  54,46.61 180 top
R4  43.82,63.94 180 top
R5  41.43,8.77 270 top
R6  58.91,38.61 0 top
R7  58.91,41.39 0 top
R8  41.81,68.25 90 top
R9  40.1,60.96 0 top
R10  42.23,56.08 270 top
R11  52.69,27.33 90 top
R12  49.35,17.93 270 top
R13  49.28,63.51 180 top
R14  33.52,30.72 90 top
R15  50,37.33 270 top
R16  47.33,39.21 270 top
R17  11.45,37.19 90 top
R18  11.45,42.98 270 top
R19  54,73 0 bottom
R20  60,63 0 bottom
R21  64.05,53.07 0 bottom
R22  64.7,44.52 0 bottom
R23  66.83,40.13 0 bottom
R24  64,27 0 bottom
R25  61,17 0 bottom
R26  56,7 0 bottom
R27  54,76 0 bottom
R28  60,66 0 bottom
R29  64,56 0 bottom
R30  64.7,47.83 0 bottom
R31  65,34 0 bottom
R32  64,24 0 bottom
R33  61,14 0 bottom
R34  56,4 0 bottom
R35  57.42,69.53 270 bottom
R36  30.96,50.29 180 top
R37  31.87,53.34 270 bottom
R38  34.61,52.43 90 top
RESET  56,21 135 top
SJ1  40.4,55.78 270 bottom
SJ2  37.97,55.78 270 bottom
T1  39.49,64.92 0 top
T2  39.49,58.22 180 top
TP1  43.15,16.46 0 top
TP2  42.54,60.05 90 top
TP3  29.62,19.42 0 top
TP4  2,18 0 top
U1  32.78,57.61 0 top
U2  36.7,20.81 180 top
U3  37.07,40.08 135 top
U$1  12.36,47.85 0 top
U$2  61,75 180 bottom
U$3  12.36,32 0 top
U$4  21,47 90 top
U$5  21,33 270 top
U$6  53,40 90 top
U$7  44,68 355 top
U$8  44,75 355 top
U$9  44,12 5 top
U$10  44,5 5 top
U$11  56,49 45 top
U$12  62,43 45 top
U$13  62,37 315 top
U$14  56,31 315 top
U$15  66.02,64.84 180 bottom
U$16  69,55 180 bottom
U$17  70,45 180 bottom
U$18  70,35 180 bottom
U$19  69,25 180 bottom
U$20  66,15 180 bottom
U$21  61,5 180 bottom
USER  57,59 225 top
Y1  42.66,30.72 180 top

### Tracks (layer width: path | path; a pad name or v marks a point on that pad's centre or on a via)
+3V3  (via drill 0.35)
  Top 0.305: U$6.P$8 53.75,42.69 53.46,42.98 | 53.46,42.98 53.16,43.28 52.29,43.28 51.99,43.28 51.38,42.67 51.38,40.87 U$6.P$12 52.43,40.5 52.68,40.25 52.68,40.1 53.28,39.5 U$6.P$5 | 55.38,42.98 53.46,42.98 | U3.48 29.2,42.64 29.2,42.65 29.13,42.72 29.13,44.2 | U3.64 35.66,32.79 37.66,30.79 37.66,29.66 37.65,29.64 | C3.1 52.6,28.2 R11.2 52.31,28.66 R2.2 | U3.13 41.62,38.7 41.62,39.93 | 41.62,39.93 41.62,40.84 42.5,41.72 42.54,41.72 43.02,42.2 U3.19 | v42.23,39.62 41.93,39.62 41.62,39.93 | R3.2 52.93,46.61 52.8,46.48 v51.84,46.48 | v52.75,43.43 52.6,43.28 50.16,43.28 | U3.32 37.42,47.85 36.75,47.85 | 35.53,49.61 C1.1 34.61,50.52 R38.1 | R4.2 42.88,63.06 v43.45,62.48 | v49.55,60.96 49.55,58.98 49.7,58.83 | U1.5 29.9,56.86 29.61,56.57 29.61,56.08 | 29.61,56.08 C24.1 | U1.6 29.89,56.36 29.61,56.08 | U1.7 31.54,54.83 30.96,54.25 29.8,54.25 C24.1 | C8.1 27.43,48.33 26.99,48.77 26.99,53.03 28.52,54.56 29.5,54.56 C24.1
  Top 0.406: 25.23,36.2 IC4.1 24.01,36.2 23.95,36.27 23.95,39.32 24.86,40.23 | 24.86,39.93 24.86,40.23 | 24.86,40.23 24.86,41.15 25.31,41.59 IC2.1 | 16.63,38.41 IC5.1 18.14,39.93 v18.46,39.93 17.85,40.54 17.85,43.28 17.34,43.8 IC3.1 | 24.86,40.23 25.16,39.93 v26.08,39.93 26.99,40.84 v26.99,42.06 | C9.1 28.15,45.48 28.98,44.65 | 28.98,44.65 29.13,44.5 29.13,44.2 29.13,41.15 30.04,40.23 34.31,40.23 37.05,42.98 | C8.1 C9.1 | C9.1 28.15,45.35 v27.91,45.11 28.52,45.11 28.98,44.65 | C3.1 49.96,28.65 v48.63,28.65 | v38.88,28.96 38.2,29.64 37.65,29.64 | C19.1 52.02,43.25 51.99,43.28 | 52.29,43.28 50.16,43.28 49.85,43.28 47.72,43.28 45.59,41.15 45.59,39.01 46.34,38.26 R16.2 47.41,38.18 47.41,37.19 48.22,36.38 R15.2 52.18,36.38 52.29,36.27 v52.44,36.42 | v42.23,39.62 39.8,42.06 37.97,42.06 37.05,42.98 | 37.05,42.98 37.05,47.55 36.75,47.85 35.83,47.85 35.64,48.04 35.64,49.49 C1.1
  Top 0.508: 37.65,24.38 U2.1 41.22,22.19 41.45,22.42 | 37.65,24.38 C17.2 | C15.2 37.65,24.38 | L1.P$2 41.45,22.42 | TP1.TP 40.78,14.09 R1.2 36.16,14 33.47,16.68 10.35,16.68 9.33,15.67 BOOT.2 | 42.84,22.55 41.59,22.55 41.45,22.42 | 49.95,58.88 C2.1 50.15,59.13 | 55.75,43.28 C19.1
  Top 0.61: v26.08,39.93 24.86,39.93 | C17.2 39.01,24.81 v39.19,24.99 | v58.69,11.58 52.6,11.58 v51.99,10.97 51.99,15.24 50.25,16.98 R12.2 | C2.1 49.7,58.83 49.7,56.64 DEBUG.2 | TP1.TP v45.59,16.46
  Top 0.813: C17.2 C15.2 37.65,29.64 C16.2
  Bottom 0.305: v52.75,43.43 52.75,45.57 v51.84,46.48 | v49.55,60.96 47.72,59.13 43.45,59.13 42.54,60.05 42.54,61.57 v43.45,62.48
  Bottom 0.406: v18.46,39.93 v26.08,39.93 | v26.99,42.06 27.91,42.98 v27.91,45.11 | R34.2 55.05,6.71 R26.2 | 59.91,17.14 R25.2 | R33.2 60.05,13.24 | 64.18,33.87 R31.2 | 63.74,43.72 R22.2 | 63.1,55.95 R29.2 62.66,56.4 | 53.05,72.85 53.05,73.15 53.05,72.85 | 53.05,72.85 53.05,72.39 | 53.05,72 53.05,72.85 | v52.44,36.42 52.44,32.46 v48.63,28.65 39.19,28.65 v38.88,28.96 37.97,29.87 37.97,36.88 40.71,39.62 v42.23,39.62 | DEBUG.2 51.99,56.39 53.51,54.86 53.51,44.2 v52.75,43.43 | R20.2 59,63 59,62.95
  Bottom 0.61: 60.05,11.89 R33.2 R25.2 60.05,17.82 63.05,20.82 63.05,23.47 | 60.05,11.89 60.05,11.42 57.47,8.84 55.65,8.84 55.05,8.24 R26.2 | 63.05,23.47 R32.2 | 63.74,43.72 65.88,41.58 R23.2 65.88,37.67 64.05,35.84 R31.2 64.05,29.44 63.05,28.44 R24.2 63.05,23.47 | R22.2 R30.2 63.57,48 63.57,51.51 62.96,52.12 62.96,52.93 R21.2 63.1,55.95 | R29.2 63.05,57.52 59,61.57 59,62.95 | R20.2 R28.2 57.31,66 55.95,67.36 55.95,71.02 55.65,71.32 53.73,71.32 53.05,72 R19.2 | R27.2 53.05,72.85 | v39.19,24.99 39.19,20.42 44.37,15.24 45.28,15.24 | 45.28,15.24 50.77,15.24 51.99,14.02 v51.99,10.97 | v58.69,11.58 59.74,11.58 60.05,11.89 | v45.59,16.46 45.59,15.54 45.28,15.24
ADC0  (via drill 0.35)
  Top 0.305: U3.14 43.08,37.89 43.56,37.41 43.56,37.38 47.72,33.22 47.72,5.18 49.85,3.05 57.17,3.05 58.08,3.96 v58.08,4.88
  Bottom 0.305: U$21.P$1 58.21,5 v58.08,4.88 57.21,4 R34.1
ADC1  (via drill 0.35)
  Top 0.305: v61.74,12.19 60.52,13.41 60.52,14.63 60.52,17.07 56.56,21.03 56.56,24.38 56.56,29.87 52.9,33.53 48.22,33.53 U3.15
  Bottom 0.305: R33.1 61.74,13.79 | 61.74,13.79 61.74,12.5 | R33.1 61.74,13.79 | 61.74,13.79 v61.74,12.19 | R33.1 62.95,15 U$20.P$1
ADC2  (via drill 0.35)
  Top 0.305: v65.4,22.25 63.27,24.38 62.35,24.38 57.47,29.26 57.47,30.18 53.21,34.44 48.01,34.44 U3.16
  Bottom 0.305: v65.4,22.25 65.4,23.55 R32.1 65.95,25 U$19.P$1
ADC3  (via drill 0.35)
  Top 0.305: v65.4,32.31 59.61,32.31 57.63,34.29 | 57.63,34.29 57.47,34.44 | U3.17 43.79,39.59 48.33,35.05 56.86,35.05 57.63,34.29
  Bottom 0.305: v65.4,32.31 65.95,32.86 R31.1 65.95,34.38 66.57,35 67.23,35 | U$18.P$1 67.23,35 | 67.23,35 66.95,35
ADC4  (via drill 0.35)
  Top 0.305: v65.4,49.99 59.91,44.5 44.68,44.5 U3.20
  Bottom 0.305: R30.1 65.65,49.74 v65.4,49.99 | U$17.P$1 68.47,45 68.25,45.22
  Bottom 0.406: 68.25,45.22 R30.1
ADC5  (via drill 0.35)
  Top 0.305: U3.21 44.58,45.11 59.3,45.11 66.31,52.12 66.31,56.39 v65.09,57.61
  Bottom 0.305: v65.09,57.61 64.95,57.46 R29.1 66.6,56 U$16.P$1
ADC6  (via drill 0.35)
  Top 0.305: 61.74,51.51 61.89,51.66 | 61.89,51.66 63.27,53.03 v63.27,66.14 | 61.89,51.66 59.61,49.38 56.56,49.38 55.65,48.46 48.63,48.46 48.02,47.85 46.62,47.85 U3.22
  Bottom 0.305: R28.1 63.12,66 v63.27,66.14 63.32,66.14 U$15.P$1
ADC7  (via drill 0.35)
  Top 0.305: v57.47,74.98 59.91,72.54 59.91,71.93 59.91,59.44 62.35,57 62.35,53.34 60.98,51.97 55.19,51.97 52.29,49.07 48.02,49.07 47.41,48.46 46.52,48.46 U3.23
  Bottom 0.305: U$2.P$1 59.58,74.98 v57.47,74.98 55.97,74.98 R27.1
ADC8
  Top 0.305: U3.25 44.67,48.03 44.67,63.83 R4.1 44.77,65.6 U$7.P$2
ADC9  (via drill 0.35)
  Top 0.305: U$11.P$2 55.73,46.61 R3.1 54.95,47.63 54.73,47.85 51.99,47.85 49.85,45.72 47.41,45.72 46.81,46.33 v46.81,46.63 | U3.26 39.52,43.59 v38.27,43.59
  Bottom 0.305: v38.27,43.59 44.98,43.59 46.81,45.41 v46.81,46.63
ADC10  (via drill 0.35)
  Top 0.305: U3.8 40.9,35.83 40.1,36.63 v40.1,37.19 | v48.94,30.79 R2.1 50.41,31.96 51.07,32.61 52.9,32.61 53.82,31.7 53.82,31.06 U$14.P$2
  Bottom 0.305: v40.1,37.19 46.5,30.79 v48.94,30.79
ADC11
  Top 0.305: R1.1 42.3,12.1 42.37,12.03 42.61,12.03 U$9.P$2 46.81,13.18 46.81,31.09 44.37,33.53 43.97,33.53 U3.9
BOOT  (via drill 0.35)
  Top 0.305: U3.60 33.52,34.05 R14.2 32.45,31.67 32.17,31.39 | 32.17,31.39 28.52,27.74 v28.52,27.43 | v31.26,31.09 31.57,31.39 32.17,31.39
  Bottom 0.305: BOOT.1 6.34,12.87 10.84,17.37 22.42,17.37 27.6,22.55 27.6,26.52 v28.52,27.43 | v31.26,31.09 34.31,34.14 34.31,35.05 28.82,40.54 28.82,41.45 28.82,44.81 29.43,45.41 31.87,45.41 34.61,48.16 34.61,49.38 34.61,54.56 35.34,55.28 37.7,55.28 SJ2.2
D+  (via drill 0.35)
  Top 0.305: J1.A6 7.5,40.25 7.18,39.93 7.18,39.62 7.56,39.25 J1.B6 10.46,39.25 11.45,40.23 12.97,40.23 14.5,41.76 v14.5,42.67 | U1.3 29.07,57.86 v27.91,56.69
  Bottom 0.305: v14.5,42.67 15.11,43.28 18.15,43.28 20.9,46.02 20.9,48.16 27.91,55.17 v27.91,56.69
D-  (via drill 0.35)
  Top 0.305: J1.A7 9.75,39.75 9.93,39.93 9.93,40.54 9.71,40.75 9.62,40.75 | J1.B7 9.62,40.75 | 9.62,40.75 12.57,40.75 12.97,41.15 12.97,42.67 13.58,43.28 v13.58,43.59 | U1.4 29.49,57.36 28.82,56.69 v28.82,56.39
  Bottom 0.305: v28.82,56.39 28.82,55.17 21.51,47.85 21.51,45.72 17.55,41.76 13.58,41.76 12.97,42.37 12.97,42.98 v13.58,43.59
ENC_LEFT_A
  Top 0.305: U3.51 30.29,37.19 28.82,37.19 27.91,38.1 27.91,42.67 26.79,43.8 IC2.2
ENC_LEFT_B  (via drill 0.35)
  Top 0.305: IC3.2 15.55,41.59 v14.8,40.84 | U3.52 30.08,36.27 v28.21,36.27
  Bottom 0.305: 15.11,41.15 v14.8,40.84 26.99,40.84 27.91,39.93 27.91,36.58 v28.21,36.27
ENC_RIGHT_A
  Top 0.305: U3.53 29.88,35.36 27.6,35.36 26.69,36.27 26.69,37.8 26.08,38.41 IC4.2
ENC_RIGHT_B  (via drill 0.35)
  Top 0.305: IC5.2 14.56,36.2 v14.19,36.58 | U3.57 31.79,34.44 v30.65,34.44
  Bottom 0.305: v14.19,36.58 14.5,36.88 26.08,36.88 28.52,34.44 29.74,34.44 | 29.74,34.44 30.04,34.44 | v30.65,34.44 29.74,34.44
GND  (via drill 0.35)
  Top 0.305: R18.1 9.75,43.93 9.05,43.23 | 55.47,40.36 55.6,40.23 55.6,39.93 55.53,40 U$6.P$6 54.37,40 | U$6.P$3 U$6.P$2 | U$6.P$2 U$6.P$1 | R14.1 35.61,29.77 35.74,29.64 | U$6.P$2 52.83,38.42 52.83,37.82 53.16,37.49 54.38,37.49 v54.99,38.1 54.9,38.19 54.9,38.32 | U3.47 30.04,42.51 v30.04,44.5 | U3.63 34.61,33.02 34.61,32.46 34.63,32.45 34.63,30.76 35.53,29.86 | C22.1 38.99,49.52 | 38.99,49.52 C1.2 | U3.31 39.49,47.09 39.49,49.02 38.99,49.52 | 50.25,26.12 C3.2 | U3.12 39.49,40.13 | 39.49,40.13 39.49,40.23 | C20.2 41.56,24.93 v41.32,24.69 | C21.2 43.82,24.93 v44.06,24.69 | v44.98,42.67 44.26,42.67 U3.18 | C16.1 35.22,30.16 35.22,30.48 | 35.22,30.48 35.22,30.79 | 35.22,30.48 35.22,31.09 v35.53,31.39 | 39.49,40.13 v39.49,40.84 | 29.74,48.65 C8.2 29.61,48.77 29.61,50.29 | U$3.P$3 10.34,31.5 9.93,31.09 9.93,29.12 C6.2 | 8.4,49.53 8.4,47.85 8.9,47.35 U$1.P$3 | C4.2 10.05,49.66 9.93,49.53 | 5.2,19.96 3.17,19.96 3.17,19.83 2,18.66 TP4.TP | v21.51,42.06 21.51,42.7 IC2.3 | 3.83,35.66 6.89,35.66 6.94,35.62 9.55,35.62 9.62,35.68 | 54.21,63.79 54.66,63.33 | USER.A2 53.03,57.78 v53.82,57 | U1.PAD 32.48,57.61 31.73,58.36 U1.2 29.9,58.36 v29.13,59.13 29.13,63.4 30.04,64.31 v30.04,64.11 | C25.2 3.83,47.24 | 29.61,50.29 C24.2 | R36.2 29.61,50.29
  Top 0.406: IC5.3 IC4.3 IC2.3 IC3.3 | 55.72,40.54 C19.2 55.47,41.1 55.47,40.36 55.33,40.5 U$6.P$7 | 55.72,40.54 55.72,40.23 | 55.72,40.23 55.72,39.13 55.47,38.89 54.9,38.32 | v30.04,44.5 30.04,46.33 30.04,46.45 C9.2 C8.2 | LED1.C 53.85,21.67 54.78,22.61 RESET.A2 54.27,25.91 v54.27,26.98 | C18.2 49.38,25.26 50.25,26.12 | C3.2 48.86,26.3 48.63,26.52 v48.79,26.67 | 55.72,41.15 55.72,40.54 | U$6.P$6 55.48,40 55.72,40.23 | C22.1 37.67,49.68 C1.2 37.51,50.75 v37.05,51.21 | TP3.TP 29.63,19.44 30.72,19.44 | 54.66,63.33 55.34,62.66 55.34,60.52 55.1,60.28 53.58,58.76 USER.A2 | LED2.C 54.21,63.79
  Top 0.508: J1.GND 8.66,43.74 J1.SHLD1 3.95,44.32 3.83,44.2 | J1.GND2 8.66,36.26 J1.SHLD2 | J1.SHLD2 8.07,35.66 | 10.05,49.86 C4.2 | 9.93,49.53 8.4,49.53 3.98,49.53 3.83,49.68 | C6.2 8.97,29 7.49,30.48 3.83,30.48 | 3.83,48.77 v5.66,48.77 | J1.SHLD2 9.62,35.68 10.89,35.68 R17.1 | LED1.C 53.85,15.92 | 35.53,29.86 35.74,29.64 | C19.2 55.72,41.15
  Top 0.61: DEBUG.1 47.8,56.78 C2.2 | C8.2 30.05,46.34 30.04,46.33 | R9.1 39.15,59.93 T2.2
  Top 0.813: U2.4 34,19.44 32.78,19.44 | 32.78,19.44 30.72,19.44 30.3,19.85 30.3,20.42 C14.1 14.85,21.39 12.97,19.51 5.66,19.51 5.2,19.96 4.3,20.87 4.3,23 | C13.1 33,19.65 32.78,19.44 | C17.1 C15.1 | C15.1 35.36,26.82 v34,26.82 | C16.1 35.74,29.64 C15.1 | v38.58,60.66 38.88,60.96 R9.1
  Top 1.27: BATT.1 5,57.25 C10.- 4.75,54.87 3.83,53.95 3.83,49.68 3.83,48.77 3.83,47.24 3.83,44.2 3.83,35.66 3.83,31.09 3.83,30.48 3.83,23.47 4.3,23 C11.-
  Bottom 0.305: v39.49,40.84 39.8,40.54 39.8,40.23 | v30.04,64.11 30.35,63.8 30.35,63.4
  Bottom 0.406: v48.79,26.67 48.94,26.52 48.02,27.43 | 34,25.6 37.05,25.6 38.88,27.43 40.71,27.43 | 40.71,27.43 43.76,27.43 | 43.76,27.43 48.02,27.43 | v41.32,24.69 40.71,25.3 40.71,27.43 | v44.06,24.69 43.76,24.99 43.76,27.43 | 48.02,27.43 53.82,27.43 | 53.82,27.43 v54.27,26.98 | 53.82,27.43 56.56,27.43 57.06,27.93 U$14.P$1 54.99,34.13 54.99,36.27 54.99,36.88 | 54.99,36.88 v54.99,38.1 | 54.99,36.88 54.99,43.54 58.69,47.24 58.69,50.6 | 58.69,50.6 58.69,55.47 55.19,58.98 | U$11.P$1 55.48,50.6 58.69,50.6 | v44.98,42.67 42.84,40.54 40.1,40.54 39.8,40.23 39.64,40.08 | 39.64,40.08 37.05,37.49 37.05,35.05 | 37.05,35.05 37.05,31.7 36.75,31.39 v35.53,31.39 | 37.05,35.05 33.09,39.01 30.35,41.76 30.35,44.2 v30.04,44.5 | U$7.P$1 44.67,69.49 51.07,63.09 52.44,61.72 | 55.19,58.98 52.44,61.72 | DEBUG.1 47.41,56.69 52.44,61.72 | v37.05,51.21 37.05,42.67 39.64,40.08 | v53.82,57 53.82,57.61 55.19,58.98
  Bottom 0.61: 38.88,11.28 35.53,11.28 34,12.8 34,19.51 | 38.88,11.28 40.32,9.84 40.32,9.21 40.47,8.78 41.62,7.62 41.62,5.3 42.88,1.54 42.89,1.52 60.83,1.52 62.75,3.45 62.75,4.65 U$21.P$2 63.39,5 67.53,9.14 67.53,14.87 U$20.P$2 68.21,15 70.58,17.37 70.58,24.82 U$19.P$2 | U$9.P$1 41.65,11.28 38.88,11.28 | 58.39,70.48 60.59,70.48 61.13,71.02 61.13,73.73 U$2.P$2 | U$2.P$2 67.42,69.98 U$15.P$2 67.64,64.62 69.06,64.62 70.4,63.27 U$16.P$2 71.66,55 73.02,53.65 73.02,45.72 | U$17.P$2 72.3,45 73.02,45.72 | 73.02,45.72 73.02,35.36 | U$18.P$2 72.66,35 73.02,35.36 | 73.02,35.36 73.02,26.52 71.49,24.99 U$19.P$2 | U$19.P$2 | v63.87,73.76 63.64,73.76 U$2.P$2
  Bottom 0.813: BATT.1 6.47,63.4 30.35,63.4 35.83,63.4 v38.58,60.66 | v34,26.82 34,25.6 34,24.08 34,19.51 v34,18.9 | Q1.2 58.39,70.48 R35.1
  other vias: 8.1,28.65 3.52,32.92 9.62,45.11 32.48,18.9 5.96,61.57 5.96,60.35 4.13,61.57 4.13,60.35 4.13,59.13 5.96,59.13 20.9,38.4 15.72,39.93 26.38,61.57 13.89,61.57 26.38,19.51 15.41,19.2 9.32,68.28 21.2,64.92 15.11,13.72 33.09,11.58 20.9,69.19 26.08,24.69 20.29,21.64 26.99,14.63 14.19,24.38 4.13,25.6 30.96,18.9 20.9,33.53 39.49,30.18 32.48,26.82 32.48,25.3 46.81,2.74 36.75,38.71 38.27,48.16 29.13,39.01 57.47,27.43 52.29,20.42 48.94,13.72 45.59,18.9 45.59,23.16 45.89,66.14 50.46,65.84 50.77,74.37 46.5,71.32 64.79,59.44 58.08,54.25 67.53,49.07 66.92,30.78 62.66,30.48 64.79,19.81 57.47,14.33 62.05,10.06 52.6,5.18 46.2,10.36 59,43.28 16.63,29.57 25.77,29.57 23.95,67.97 14.19,57.3 19.68,57.3 8.4,50.9 58.64,34.44 57.47,21.95 55.34,20.73 56.86,64.62 62.05,50.29 60.22,21.95 23.64,46.94 69.06,59.44 72.41,40.54 64.18,39.93 68.75,19.51 36.75,64.92 40.71,53.34 41.93,58.52 24.56,49.68 18.76,53.64 16.63,50.6 35.53,42.98 41.01,42.37 28.21,49.99 26.99,55.47 28.21,52.43 26.08,51.21 23.64,52.12 31.26,61.87
  pour Bottom: -8.06,93.57 90.09,93.57 90.09,-14.02 -8.06,-14.02
  pour Top: -15.37,102.41 89.48,102.41 89.48,-33.53 -15.68,-33.53 -15.68,102.41
IR_LED
  Top 0.305: U3.29 42.23,48.42 R10.2
LED  (via drill 0.35)
  Top 0.305: U3.27 44.06,48.84 44.06,55.47 43.76,55.78 v43.76,61.27 | R13.2 48.33,62.79 v47.41,61.87
  Bottom 0.305: v43.76,61.27 44.37,61.87 v47.41,61.87
LINE_LED  (via drill 0.35)
  Top 0.305: U3.24 45.89,48.54 45.89,59.13 | 45.89,59.13 45.89,59.44 45.89,59.74 | v58.39,67.67 49.55,67.67 45.89,64.01 45.89,59.13
  Bottom 0.305: v58.39,67.67 57.47,68.58 R35.2
  Bottom 0.813: Q1.1 R35.2
N$1
  Top 0.305: 13.89,49.38 12.99,48.48 U$1.P$6
  Top 0.406: 13.89,49.38 23.03,49.38 25,47.41 U$4.P$2
N$2
  Top 0.305: U$1.P$4 13.47,47.35 13.89,46.94
  Top 0.406: 13.89,46.94 14.19,46.63 16.33,46.63 17,45.96 U$4.P$1
N$3
  Top 0.305: U$3.P$6 13.47,32.5 13.89,32.92
  Top 0.406: 13.89,32.92 15.47,34.5 U$5.P$2
N$4
  Top 0.305: U$3.P$4 13.17,31.5 13.89,30.79
  Top 0.406: 13.89,30.79 22.42,30.79 25,33.36 U$5.P$1
N$5
  Top 0.61: U$10.P$2 42.99,3.51 41.93,4.57 41.84,4.66 41.43,5.89 R5.2
N$6
  Top 0.406: R6.2 60.94,37.53 U$13.P$2
N$7
  Top 0.406: R7.2 60.41,41.94 U$12.P$2
N$8
  Top 0.406: R8.2 42.54,69.92 42.54,72.17 U$8.P$2
N$9  (via drill 0.35)
  Top 0.305: U1.19 34.84,59.66 v34.92,59.74
  Bottom 0.305: v34.92,59.74 35.83,59.74 37.97,57.61 SJ2.1
N$10
  Top 0.305: R9.2 41.05,59.93 40.94,59.82 T2.1
  Top 0.61: TP2.TP 41.96,60.05 R9.2 40.99,61.02 T1.E 40.99,59.87 40.94,59.82
N$11
  Top 0.305: J1.B5 11.33,38.25 R17.2
N$12
  Top 0.508: U2.6 38.58,18.51 38.58,16.88 C12.1
N$13
  Top 0.508: U2.5 36.74,19.39 C12.2 36.74,15.55 37.05,15.24 40.1,15.24 41.7,16.84 L1.P$1
N$14
  Top 0.305: R10.1 39.57,57.03 T2.3 39.3,57.3 37.66,57.3 37.36,57.61 37.36,62.31 T1.B
N$15  (via drill 0.35)
  Top 0.406: 41.46,9.75 42.54,9.75 v43.76,8.53 | v56.86,37.8 57.15,37.8 R6.1 R7.1
  Top 0.61: R5.1 41.46,9.75 | R8.1 41.38,67.3 | R8.1 42.48,67.97 48.33,67.97 v48.48,68.12 | R8.1 40.05,65.53 39.19,65.53 39.19,63.5 T1.C
  Bottom 0.406: v43.76,8.53 51.38,8.53 53.51,10.67 53.51,16.46 59.91,22.86 59.91,34.75 59,35.66 57.78,36.88 57.78,37.49 | 57.78,37.49 57.78,43.89 57.78,44.81 59.91,46.94 59.91,55.47 53.21,62.18 53.21,67.67 51.99,68.89 49.24,68.89 v48.48,68.12 | v56.86,37.8 57.47,37.8 57.78,37.49
N$16
  Top 0.305: LED1.A 49.39,18.85 R12.1
N$17
  Top 0.406: R13.1 50.23,62.81 LED2.A
N$18
  Top 0.305: J1.A5 10.67,41.25 R18.2
N$19
  Top 0.305: U3.5 39.9,34.71 40.38,34.23 40.38,30.5 41.05,29.84 Y1.3 41.56,29.76 C20.1
N$20
  Top 0.305: U3.6 40.3,35.13 Y1.1 44.48,31.59 44.98,31.09 44.98,28.93 C21.1
N$21
  Bottom 0.305: R19.1 55.95,72 LED3.A
N$22
  Bottom 0.305: LED4.A 61.95,62 R20.1
N$23
  Top 0.305: U3.30 41.05,47.94 C22.2
N$24
  Bottom 0.406: R21.1 66.18,53.07 LED5.A
N$25
  Bottom 0.406: LED6.A 68.17,42 R22.1
N$26
  Bottom 0.406: R23.1 68.25,39.66 LED7.A
N$27
  Bottom 0.406: R24.1 65.95,28 LED8.A
N$28
  Bottom 0.406: R25.1 62.95,18 LED9.A
N$29
  Bottom 0.406: R26.1 57.95,8 LED10.A
N$30
  Bottom 0.406: LED6.C 70.03,42 69.97,42.06 | LED7.C 70.07,38 69.97,38.1 | LED10.C 63.34,8 | LED9.C 66.03,18 66.01,17.98 | LED8.C 69.1,28 69.06,28.04
  Bottom 0.61: LED3.C 63.57,71.18 63.57,69.8 63.3,69.53 Q1.3 64.45,69.53 66.01,67.97 66.01,61.87 | 66.01,61.87 66.01,59.74 69.06,56.69 69.06,51.82 | 69.06,51.82 69.06,47.55 69.97,46.63 69.97,42.06 69.97,38.1 69.97,30.48 69.06,29.57 69.06,28.04 69.06,22.25 66.01,19.2 66.01,17.98 66.01,11.26 LED10.C | LED5.C 69.24,52 69.06,51.82 | LED4.C 66.13,62 66.01,61.87
N$31  (via drill 0.35)
  Top 0.305: U1.23 32.03,61.12 v33.09,62.18
  Bottom 0.305: v33.09,62.18 34.92,62.18 39.19,57.91 | 39.19,57.91 39.49,57.61 | 39.91,57.18 39.64,57.45 | 39.64,57.45 39.19,57.91 | SJ1.1 39.64,57.3 39.64,57.45
N$32
  Top 0.305: U1.9 32.53,54.5 33.09,53.95 34.04,53.95 R38.2
N$38  (via drill 0.35)
  Top 0.305: U1.8 32.03,50.42 | 32.03,50.42 R36.1 | v31.26,51.51 32.03,50.74 32.03,50.42
  Bottom 0.305: R37.2 31.87,52.12 v31.26,51.51
PWM_LEFT_A  (via drill 0.35)
  Top 0.305: U3.37 33.7,45.92 33.7,48.16 v33.09,48.77 | U$1.P$1 10.95,48.35 v10.53,48.77
  Bottom 0.305: v10.53,48.77 10.53,47.55 10.23,47.24 9.01,47.24 8.4,47.85 8.4,49.38 11.14,52.12 19.68,52.12 28.52,60.96 31.57,60.96 33.7,58.83 33.7,49.38 v33.09,48.77
PWM_LEFT_B  (via drill 0.35)
  Top 0.305: U$1.P$2 9.93,47.85 v9.32,48.46 | U3.38 33.09,45.83 33.09,46.63 v32.17,47.55
  Bottom 0.305: 28.82,60.35 19.98,51.51 11.45,51.51 9.32,49.38 v9.32,48.46 | 28.82,60.35 22.73,54.25 | 28.82,60.35 31.26,60.35 33.09,58.52 33.09,49.94 32.17,49.02 v32.17,47.55
PWM_RIGHT_A  (via drill 0.35)
  Top 0.305: U3.58 30.36,32.31 v28.52,32.31 | U$3.P$1 10.34,32.5 v9.62,33.22
  Bottom 0.305: v28.52,32.31 16.63,32.31 14.8,34.14 11.45,34.14 10.84,33.53 9.93,33.53 v9.62,33.22
PWM_RIGHT_B  (via drill 0.35)
  Top 0.305: U3.59 29.85,31.09 v28.52,31.09 | U$3.P$2 v9.62,32
  Bottom 0.305: v28.52,31.09 16.63,31.09 14.19,33.53 13.28,33.53 12.97,33.22 11.75,32 v9.62,32
RESET  (via drill 0.35)
  Top 0.305: v45.89,26.52 45.89,31.09 44.74,32.24 44.74,32.27 44.56,32.45 43.64,32.45 U3.7 40.59,35.48 40.48,35.58 39.8,36.27 v38.88,36.27 | v52.9,23.47 52.75,23.32 | 52.75,23.32 51.65,22.22 RESET.B2 49.62,22.22 C18.1 | R11.1 52.69,23.38 52.75,23.32
  Top 0.508: 51.36,21.98 RESET.B2
  Bottom 0.305: v45.89,26.52 48.63,23.77 51.38,23.77 | 51.38,23.77 51.99,23.77 | 51.38,23.77 52.6,23.77 v52.9,23.47 | 47.93,55.14 47.96,55.17 | 47.96,55.17 48.33,55.17 48.66,54.84 48.66,50.79 48.63,50.77 48.63,42.98 44.22,38.56 43.76,38.1 39.9,38.1 38.88,37.08 v38.88,36.27 | 47.96,55.17 47.93,55.14 | SJ1.2 40.53,55.14 47.93,55.14
SCL  (via drill 0.35)
  Top 0.305: U3.11 42.95,35.97 v43.76,35.97 | U$6.P$13 47.49,40 R16.1 47.95,40.16 v48.94,41.15
  Bottom 0.305: v43.76,35.97 45.59,35.97 48.48,38.86 | 48.48,38.86 49.85,40.23 49.85,51.21 DEBUG.6 | v48.94,41.15 48.94,39.32 48.48,38.86
SDA  (via drill 0.35)
  Top 0.305: U3.10 43.77,34.44 v44.67,34.44 | U$6.P$14 50.34,39.5 50,39.16 R15.1 50.89,38.28 51.07,38.1 v51.38,38.1
  Bottom 0.305: v44.67,34.44 45.89,34.44 50.16,38.71 | 50.77,46.33 50.77,39.32 50.16,38.71 | 50.77,46.33 50.77,46.63 | 50.77,46.33 50.77,48.77 52.29,50.29 52.29,53.03 51.48,53.85 DEBUG.4 | v51.38,38.1 50.77,38.1 50.16,38.71
UART_RX  (via drill 0.35)
  Top 0.305: U3.43 32.78,42.59 v32.78,41.76 | v37.05,53.65 36.59,54.1 36.59,59.98 35.27,61.31 | 35.16,61.42 35.27,61.31 | U1.21 33.03,60.91 33.7,61.57 35.01,61.57 35.27,61.31
  Bottom 0.305: DEBUG.3 45.69,52.12 38.27,52.12 37.05,53.34 | v37.05,53.65 37.05,53.34 | v32.78,41.76 32.78,42.98 35.53,45.72 35.53,50.29 35.22,50.6 35.22,53.34 35.53,53.65 36.75,53.65 37.05,53.34
UART_TX  (via drill 0.35)
  Top 0.305: U3.42 33.41,42.67 v33.7,42.67 | v36.14,52.43 36.02,52.54 36.02,56.28 36.14,56.17 36.14,59.74 34.92,60.96 34,60.96 33.53,60.49 U1.20
  Bottom 0.305: DEBUG.5 38.17,51.31 37.05,52.43 36.44,52.43 | 36.44,52.43 v36.14,52.43 | v33.7,42.67 36.14,45.11 36.14,52.12 36.44,52.43
USER_KEY  (via drill 0.35)
  Top 0.305: U3.28 42.8,48.28 | 42.8,48.28 42.84,48.28 | USER.B2 50.86,49.68 47.11,49.68 v46.81,49.38 | v43.15,49.38 43.15,48.63 42.8,48.28
  Bottom 0.305: v46.81,49.38 v43.15,49.38
VCC  (via drill 0.35)
  Top 0.305: C4.1 11.91,50.96 11.91,50.7 12.87,50.7 v13.43,50.14 13.58,49.99 | 11.99,28.96 C6.1 | U$1.P$5 v14.19,47.85 | U$3.P$5 13.89,32
  Top 0.406: 13.89,32 v14.19,32 | v12.67,27.13 12.67,28.28 C6.1
  Top 0.508: C5.1 7.68,52.73 11.45,52.73 12.06,52.12 12.06,51.11 C4.1 | v6.57,54.56 7.18,55.17 v7.79,55.17 8.4,54.56 v9.01,54.56 | v8.1,24.38 8.1,24.22 9.32,23 8.1,21.78 v8.1,21.34 | C7.1 8.43,26.52 10.84,26.52 11.25,26.93 | 11.95,27.63 C6.1 11.95,27.63 | 11.25,26.93 11.95,27.63 | C11.+ 11.25,26.93 | 11.25,26.93 11.95,27.63 | 11.95,27.63 11.25,26.93 | U2.2 36.7,22.91 36.32,23.29 35.53,23.29 | 35.53,23.29 C13.2 | U2.3 35.74,23.07 35.53,23.29 | D1.C 7.11,32.07 v7.49,31.7
  Top 0.61: v44.06,78.33 42.83,77.1 42.83,76.49
  Top 0.813: C13.2 C14.2 | 30.35,23.33 C14.2 | C11.+ 28.66,23 28.95,23.29 C14.2 | C10.+ 23.74,69.49 39.51,69.49 39.84,69.83 40.16,69.99 40.24,70.23 40.42,70.41 40.42,70.77 41.32,73.45 42.54,74.68 42.54,76.2 42.83,76.49 U$8.P$1
  Top 1.27: 7.79,60.46 C10.+ 11.95,56.3 C4.1 | BATT.2 6.88,67.67 7.79,66.75 7.79,62.79 7.79,60.46 | v8.1,22.55 8.54,23 9.32,23 C11.+ | 7.79,60.46 v7.79,55.17
  Bottom 0.305: v14.19,47.85 13.89,48.16 13.89,49.68 v13.43,50.14
  Bottom 0.406: U$10.P$1 44.38,7.01 51.68,7.01 54.73,10.06 54.73,14.94 61.44,21.64 61.44,34.14 62.66,35.36 62.66,36.58 61.74,37.49 61.74,39.32 61.77,39.35 | v14.19,32 14.19,28.65 v12.67,27.13
  Bottom 0.508: v6.57,54.56 6.88,54.25 7.18,53.95 7.79,53.95 8.71,53.95 9.01,54.25 v9.01,54.56 | v8.1,24.38 v8.1,22.55 v8.1,21.34 | v7.49,31.7 6.35,31.7
  Bottom 0.61: U$13.P$1 61.77,39.35 60.94,40.18 U$12.P$1 60.94,57.19 55.03,63.09 55.03,69.19 53.82,70.41 50.77,70.41 48.02,73.15 48.02,76.2 45.89,78.33 v44.06,78.33
  Bottom 1.27: v7.79,55.17 7.79,53.95 | 6.88,54.25 6.88,46.03 5.92,45.07 5.92,44.11 5.88,44.07 5.88,34.46 6.35,33.99 | 6.35,34.14 6.35,33.99 | 6.35,33.99 6.35,31.7 6.35,24.3 v8.1,22.55
VCCINT  (via drill 0.35)
  Top 0.305: C25.1 7.22,46.94 8.1,46.94 9.01,46.02 v11.14,46.02
  Top 0.508: J1.VBUS1 9.84,42.45 v9.93,42.37 | J1.VBUS2 9.87,37.55 9.93,37.49 v9.93,36.88 | v8.4,34.44 8.33,34.37 D1.A
  Bottom 0.305: v11.14,46.02 12.06,45.11 12.06,44.5 | 24.25,53.95 26.08,55.78 26.08,56.69 27.6,58.22 29.74,58.22 31.87,56.08 R37.1
  Bottom 0.406: 24.25,53.95 19.68,49.38 17.85,49.38 14.8,46.33 13.89,46.33 12.06,44.5 v9.93,42.37
  Bottom 0.508: v9.93,42.37 v9.93,36.88 9.93,34.75 9.62,34.44 v8.4,34.44

### Text on the board
tNames: + | user | gnd | + | + | reset | boot